# Altium schematic sheet Board.SchDoc
size A3
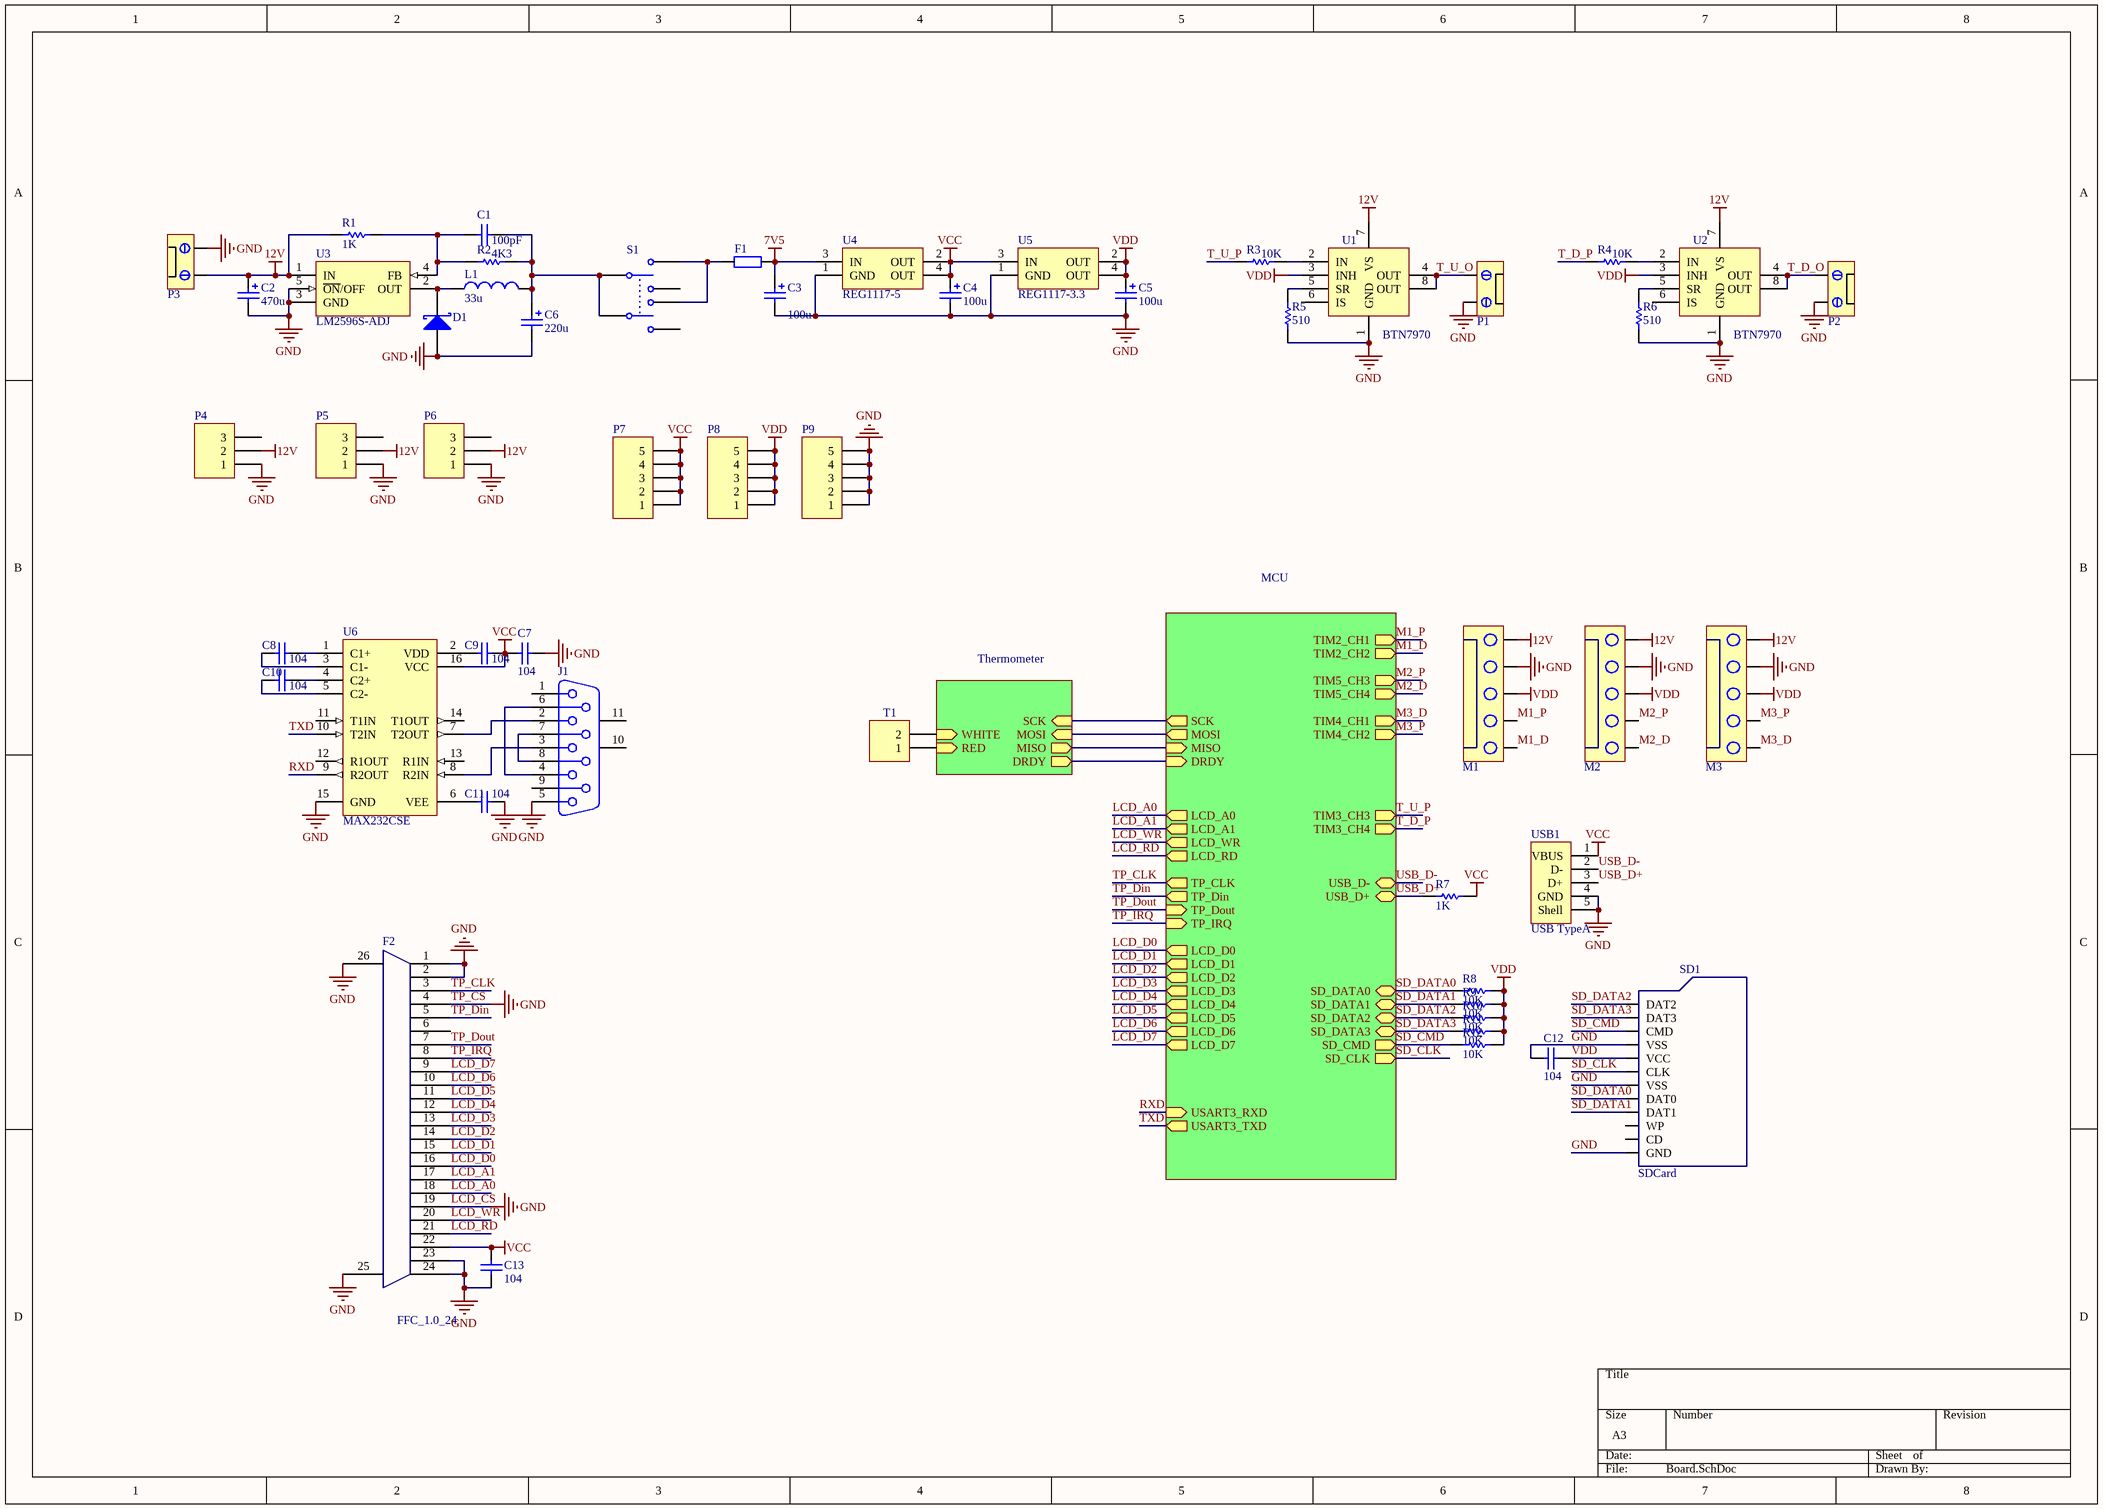
[diagram p0: Board.SchDoc]

## Parts
C1  value 100pF  [CR2012-0805]  (hidden comment: Cap)
C2  value 470u  [CAP POL Surface MOUNT-10]  (hidden comment: Cap Pol3)
C3  value 100u  [CAP POL Surface Mount-6.3]  (hidden comment: Cap Pol3)
C4  value 100u  [CAP POL Surface Mount-6.3]  (hidden comment: Cap Pol3)
C5  value 100u  [CAP POL Surface Mount-6.3]  (hidden comment: Cap Pol3)
C6  value 220u  [CAP POL Surface Mount-6.3]  (hidden comment: Cap Pol3)
C7  value 104  [CR2012-0805]  (hidden comment: Cap)
C8  value 104  [CR2012-0805]  (hidden comment: Cap)
C9  value 104  [CR2012-0805]  (hidden comment: Cap)
C10  value 104  [CR2012-0805]  (hidden comment: Cap)
C11  value 104  [CR2012-0805]  (hidden comment: Cap)
C12  value 104  [CR2012-0805]  (hidden comment: Cap)
C13  value 104  [CR2012-0805]  (hidden comment: Cap)
D1  D Schottky  [DSO-C2/X2.3]  (value not drawn)
F1  FB  [CR2012-0805]  (value not drawn)
F2  FFC_1.0_24  [FFC/SM1.0-2H24]
J1  D Connector 9  [DSUB1.385-2H9]  (value not drawn)
L1  value 33u  [inductor]  (hidden comment: Inductor)
M1  ConnP_5  [Conn_5-5.08]  (value not drawn)
M2  ConnP_5  [Conn_5-5.08]  (value not drawn)
M3  ConnP_5  [Conn_5-5.08]  (value not drawn)
P1  ConnP_2  [Conn_2-5.08]  (value not drawn)
P2  ConnP_2  [Conn_2-5.08]  (value not drawn)
P3  ConnP_2  [Conn_2-5.08]  (value not drawn)
P4  Header 3  [HDR1X3]  (value not drawn)
P5  Header 3  [HDR1X3]  (value not drawn)
P6  Header 3  [HDR1X3]  (value not drawn)
P7  Header 5  [HDR1X5]  (value not drawn)
P8  Header 5  [HDR1X5]  (value not drawn)
P9  Header 5  [HDR1X5]  (value not drawn)
R1  value 1K  [CR2012-0805]  (hidden comment: Res)
R2  value 4K3  [CR2012-0805]  (hidden comment: Res)
R3  value 10K  [CR2012-0805]  (hidden comment: Res)
R4  value 10K  [CR2012-0805]  (hidden comment: Res)
R5  value 510  [CR2012-0805]  (hidden comment: Res)
R6  value 510  [CR2012-0805]  (hidden comment: Res)
R7  value 1K  [CR2012-0805]  (hidden comment: Res)
R8  value 10K  [CR2012-0805]  (hidden comment: Res)
R9  value 10K  [CR2012-0805]  (hidden comment: Res)
R10  value 10K  [CR2012-0805]  (hidden comment: Res)
R11  value 10K  [CR2012-0805]  (hidden comment: Res)
R12  value 10K  [CR2012-0805]  (hidden comment: Res)
S1  SW-DPDT  [DPDT-6]  (value not drawn)
SD1  SDCard  [SDCARD]
T1  Header 2  [HDR1X2]  (value not drawn)
U1  BTN7970  [TS7B]
U2  BTN7970  [TS7B]
U3  LM2596S-ADJ  [TS5B]
U4  REG1117-5  [ZZ311]
U5  REG1117-3.3  [ZZ311]
U6  MAX232CSE  [NSO16]
USB1  USB TypeA  [USB_A]

## Sub-sheets
Designator = Thermometer: SCK (in), MOSI (in), MISO (out), DRDY (out), WHITE (in), RED (in)
Designator = MCU: USART3_RXD (in), USART3_TXD (out), SCK (out), MOSI (out), MISO (in), DRDY (in), LCD_A0 (out), LCD_A1 (out), LCD_WR (out), LCD_RD (out), TP_CLK (out), TP_Din (out), TP_Dout (in), TP_IRQ (in), LCD_D0 (out), LCD_D1 (out), LCD_D2 (out), LCD_D3 (out), LCD_D4 (out), LCD_D5 (out), LCD_D6 (out), LCD_D7 (out), TIM2_CH1 (out), TIM2_CH2 (out), TIM5_CH3 (out), TIM5_CH4 (out), TIM3_CH3 (out), TIM3_CH4 (out), TIM4_CH1 (out), TIM4_CH2 (out), SD_DATA3 (bidir), SD_DATA0 (bidir), SD_DATA1 (bidir), SD_DATA2 (bidir), SD_CMD (out), SD_CLK (out), USB_D+ (bidir), USB_D- (bidir)

## Nets
7V5: C3.1 F1.2 U4.3(IN)
12V: C2.1 M1.5 M2.5 M3.5 P3.1 P4.2 P5.2 P6.2 R1.1 U1.7(VS) U2.7(VS) U3.1(IN)
GND: C2.2 C3.2 C4.2 C5.2 C6.2 C7.1 C11.1 C12.1 C13.1 D1.1(A) F2.1 F2.2 F2.4 F2.19 F2.23 F2.24 F2.25 F2.26 J1.5 M1.4 M2.4 M3.4 P1.2 P2.2 P3.2 P4.1 P5.1 P6.1 P9.1 P9.2 P9.3 P9.4 P9.5 R5.1 R6.1 SD1.0(GND) SD1.3(VSS) SD1.6(VSS) U1.1(GND) U2.1(GND) U3.3(GND) U3.5(~{ON}/OFF) U4.1(GND) U5.1(GND) U6.15(GND) USB1.4(GND) USB1.5(Shell)  [also labelled LCD_CS, TP_CS]
VCC: C4.1 C7.2 C9.1 C13.2 F2.22 P7.1 P7.2 P7.3 P7.4 P7.5 R7.1 U4.2(OUT) U4.4(OUT) U5.3(IN) U6.16(VCC) USB1.1(VBUS)
VDD: C5.1 C12.2 M1.3 M2.3 M3.3 P8.1 P8.2 P8.3 P8.4 P8.5 R8.2 R9.2 R10.2 R11.2 R12.2 SD1.4(VCC) U1.3(INH) U2.3(INH) U5.2(OUT) U5.4(OUT)
LCD_A0: F2.18 ; sheet Designator/LCD_A0
LCD_A1: F2.17 ; sheet Designator/LCD_A1
LCD_D0: F2.16 ; sheet Designator/LCD_D0
LCD_D1: F2.15 ; sheet Designator/LCD_D1
LCD_D2: F2.14 ; sheet Designator/LCD_D2
LCD_D3: F2.13 ; sheet Designator/LCD_D3
LCD_D4: F2.12 ; sheet Designator/LCD_D4
LCD_D5: F2.11 ; sheet Designator/LCD_D5
LCD_D6: F2.10 ; sheet Designator/LCD_D6
LCD_D7: F2.9 ; sheet Designator/LCD_D7
LCD_RD: F2.21 ; sheet Designator/LCD_RD
LCD_WR: F2.20 ; sheet Designator/LCD_WR
M1_D: M1.1 ; sheet Designator/TIM2_CH2
M1_P: M1.2 ; sheet Designator/TIM2_CH1
M2_D: M2.1 ; sheet Designator/TIM5_CH4
M2_P: M2.2 ; sheet Designator/TIM5_CH3
M3_D: M3.1 ; sheet Designator/TIM4_CH1
M3_P: M3.2 ; sheet Designator/TIM4_CH2
RXD: U6.9(R2OUT) ; sheet Designator/USART3_RXD
SD_CLK: SD1.5(CLK) ; sheet Designator/SD_CLK
SD_CMD: R12.1 SD1.2(CMD) ; sheet Designator/SD_CMD
SD_DATA0: R8.1 SD1.7(DAT0) ; sheet Designator/SD_DATA0
SD_DATA1: R9.1 SD1.8(DAT1) ; sheet Designator/SD_DATA1
SD_DATA2: R10.1 SD1.9(DAT2) ; sheet Designator/SD_DATA2
SD_DATA3: R11.1 SD1.1(DAT3) ; sheet Designator/SD_DATA3
T_D_O: P2.1 U2.4(OUT) U2.8(OUT)
T_D_P: R4.1 ; sheet Designator/TIM3_CH4
T_U_O: P1.1 U1.4(OUT) U1.8(OUT)
T_U_P: R3.1 ; sheet Designator/TIM3_CH3
TP_CLK: F2.3 ; sheet Designator/TP_CLK
TP_Din: F2.5 ; sheet Designator/TP_Din
TP_Dout: F2.7 ; sheet Designator/TP_Dout
TP_IRQ: F2.8 ; sheet Designator/TP_IRQ
TXD: U6.10(T2IN) ; sheet Designator/USART3_TXD
USB_D+: R7.2 USB1.3(D+) ; sheet Designator/USB_D+
USB_D-: USB1.2(D-) ; sheet Designator/USB_D-
NetC1_1: C1.1 R1.2 R2.1 U3.4(FB)
NetC1_2: C1.2 C6.1 L1.2 R2.2 S1.2 S1.5
NetC8_1: C8.1 U6.1(C1+)
NetC8_2: C8.2 U6.3(C1-)
NetC9_2: C9.2 U6.2(VDD)
NetC10_1: C10.1 U6.4(C2+)
NetC10_2: C10.2 U6.5(C2-)
NetC11_2: C11.2 U6.6(VEE)
NetD1_2: D1.2(K) L1.1 U3.2(OUT)
NetF1_1: F1.1 S1.1 S1.6
NetJ1_2: J1.2 U6.7(T2OUT)
NetJ1_3: J1.3 U6.8(R2IN)
NetJ1_4: J1.4 J1.6
NetJ1_7: J1.7 J1.8
NetR3_2: R3.2 U1.2(IN)
NetR4_2: R4.2 U2.2(IN)
NetR5_2: R5.2 U1.5(SR)
NetR6_2: R6.2 U2.5(SR)
NetT1_1: T1.1 ; sheet Designator/RED
NetT1_2: T1.2 ; sheet Designator/WHITE
(unnamed): sheet Designator/SCK, sheet Designator/SCK
(unnamed): sheet Designator/MOSI, sheet Designator/MOSI
(unnamed): sheet Designator/MISO, sheet Designator/MISO
(unnamed): sheet Designator/DRDY, sheet Designator/DRDY

Not connected (* = marked no-connect by the designer): F2 6(5); J1 1 9 10(MH1) 11(MH2); P4 3; P5 3; P6 3; S1 3 4; SD1 10(WP) 11(CD); U1 6(IS); U2 6(IS); U6 11(T1IN) 12(R1OUT) 13(R1IN) 14(T1OUT)

## Library data of the parts
C1 C7-C13 = Cap: Capacitor; Published: 8-Jun-2000; LatestRevisionDate: 17-Jul-2002; LatestRevisionNote: Re-released for DXP Platform.; Publisher: Altium Limited
C2-C6 = Cap Pol3: Polarized Capacitor (Surface Mount); Published: 8-Jun-2000; LatestRevisionDate: 17-Jul-2002; LatestRevisionNote: Re-released for DXP Platform.; PackageReference: C0805; Publisher: Altium Limited
D1 = D Schottky: Schottky Diode; Published: 8-Jun-2000; LatestRevisionDate: 17-Jul-2002; LatestRevisionNote: Re-released for DXP Platform.; Publisher: Altium Limited; Code_JEDEC: DO-214-AA
F2 = FFC/SM1.0-2H24
J1 = D Connector 9: Receptacle Assembly, 9 Position, Right Angle; PackageDocument: O; Positions: 9; Published: 15-Jun-2001; LatestRevisionDate: 17-Jul-2002; LatestRevisionNote: Re-released for DXP Platform.; DatasheetDocument: 1-Sep-1999; PackageReference: 788750; Publisher: Altium Limited; Orientation: Right Angle; Gender: Receptacle
L1 = Inductor: Code_IEC: 1005; Published: 8-Jun-2000; LatestRevisionDate: 17-Jul-2002; LatestRevisionNote: Re-released for DXP Platform.; PackageReference: 0402-A; Publisher: Altium Limited; Code_JEITA: 0402
P4-P6 = Header 3: Header, 3-Pin; LatestRevisionDate: 17-Jul-2002; LatestRevisionNote: Re-released for DXP Platform.; Publisher: Altium Limited
P7-P9 = Header 5: Header, 5-Pin; LatestRevisionDate: 17-Jul-2002; LatestRevisionNote: Re-released for DXP Platform.; Publisher: Altium Limited
R1-R12 = Res: Resistor; Published: 8-Jun-2000; LatestRevisionDate: 17-Jul-2002; LatestRevisionNote: Re-released for DXP Platform.; Publisher: Altium Limited
S1 = SW-DPDT: Double-Pole, Double-Throw Switch; Published: 24-Mar-1999; LatestRevisionDate: 17-Jul-2002; LatestRevisionNote: Re-released for DXP Platform.; Publisher: Altium Limited
T1 = Header 2: Header, 2-Pin; LatestRevisionDate: 17-Jul-2002; LatestRevisionNote: Re-released for DXP Platform.; Publisher: Altium Limited
U3 = LM2596S-ADJ: Simple Switcher Power Converter 150 kHz 3A Step Down Voltage Regulator; Note: Tab is connected to GND; Published: 15-Apr-2002; DatasheetDocument: Dec-1997; PackageReference: TS5B; Publisher: Altium Limited
U4 = REG1117-5: 800mA and 1A Low Dropout Positive Regulator 2.85V, 3.3V, 5V, and Adjustable; PackageDocument: revC; Published: 8-Jun-2000; LatestRevisionDate: 17-Jul-2002; LatestRevisionNote: Re-released for DXP Platform.; DatasheetDocument: Sep-1997; PackageReference: ZZ311; Publisher: Altium Limited
U5 = REG1117-3.3: 800mA and 1A Low Dropout Positive Regulator 2.85V, 3.3V, 5V, and Adjustable; PackageDocument: revC; Published: 8-Jun-2000; LatestRevisionDate: 17-Jul-2002; LatestRevisionNote: Re-released for DXP Platform.; DatasheetDocument: Sep-1997; PackageReference: ZZ311; Publisher: Altium Limited
U6 = MAX232CSE: +5V Powered, Multi-Channel RS-232 Driver/Receiver; Published: 16-Jan-2001; LatestRevisionDate: 17-Jul-2002; LatestRevisionNote: Re-released for DXP Platform.; PackageReference: NSO16; Publisher: Altium Limited; Code_JEDEC: MS-012-AC; Code_IPC: SO16
USB1 = USB_A